# Altium schematic sheet CablineDP.SchDoc
size B
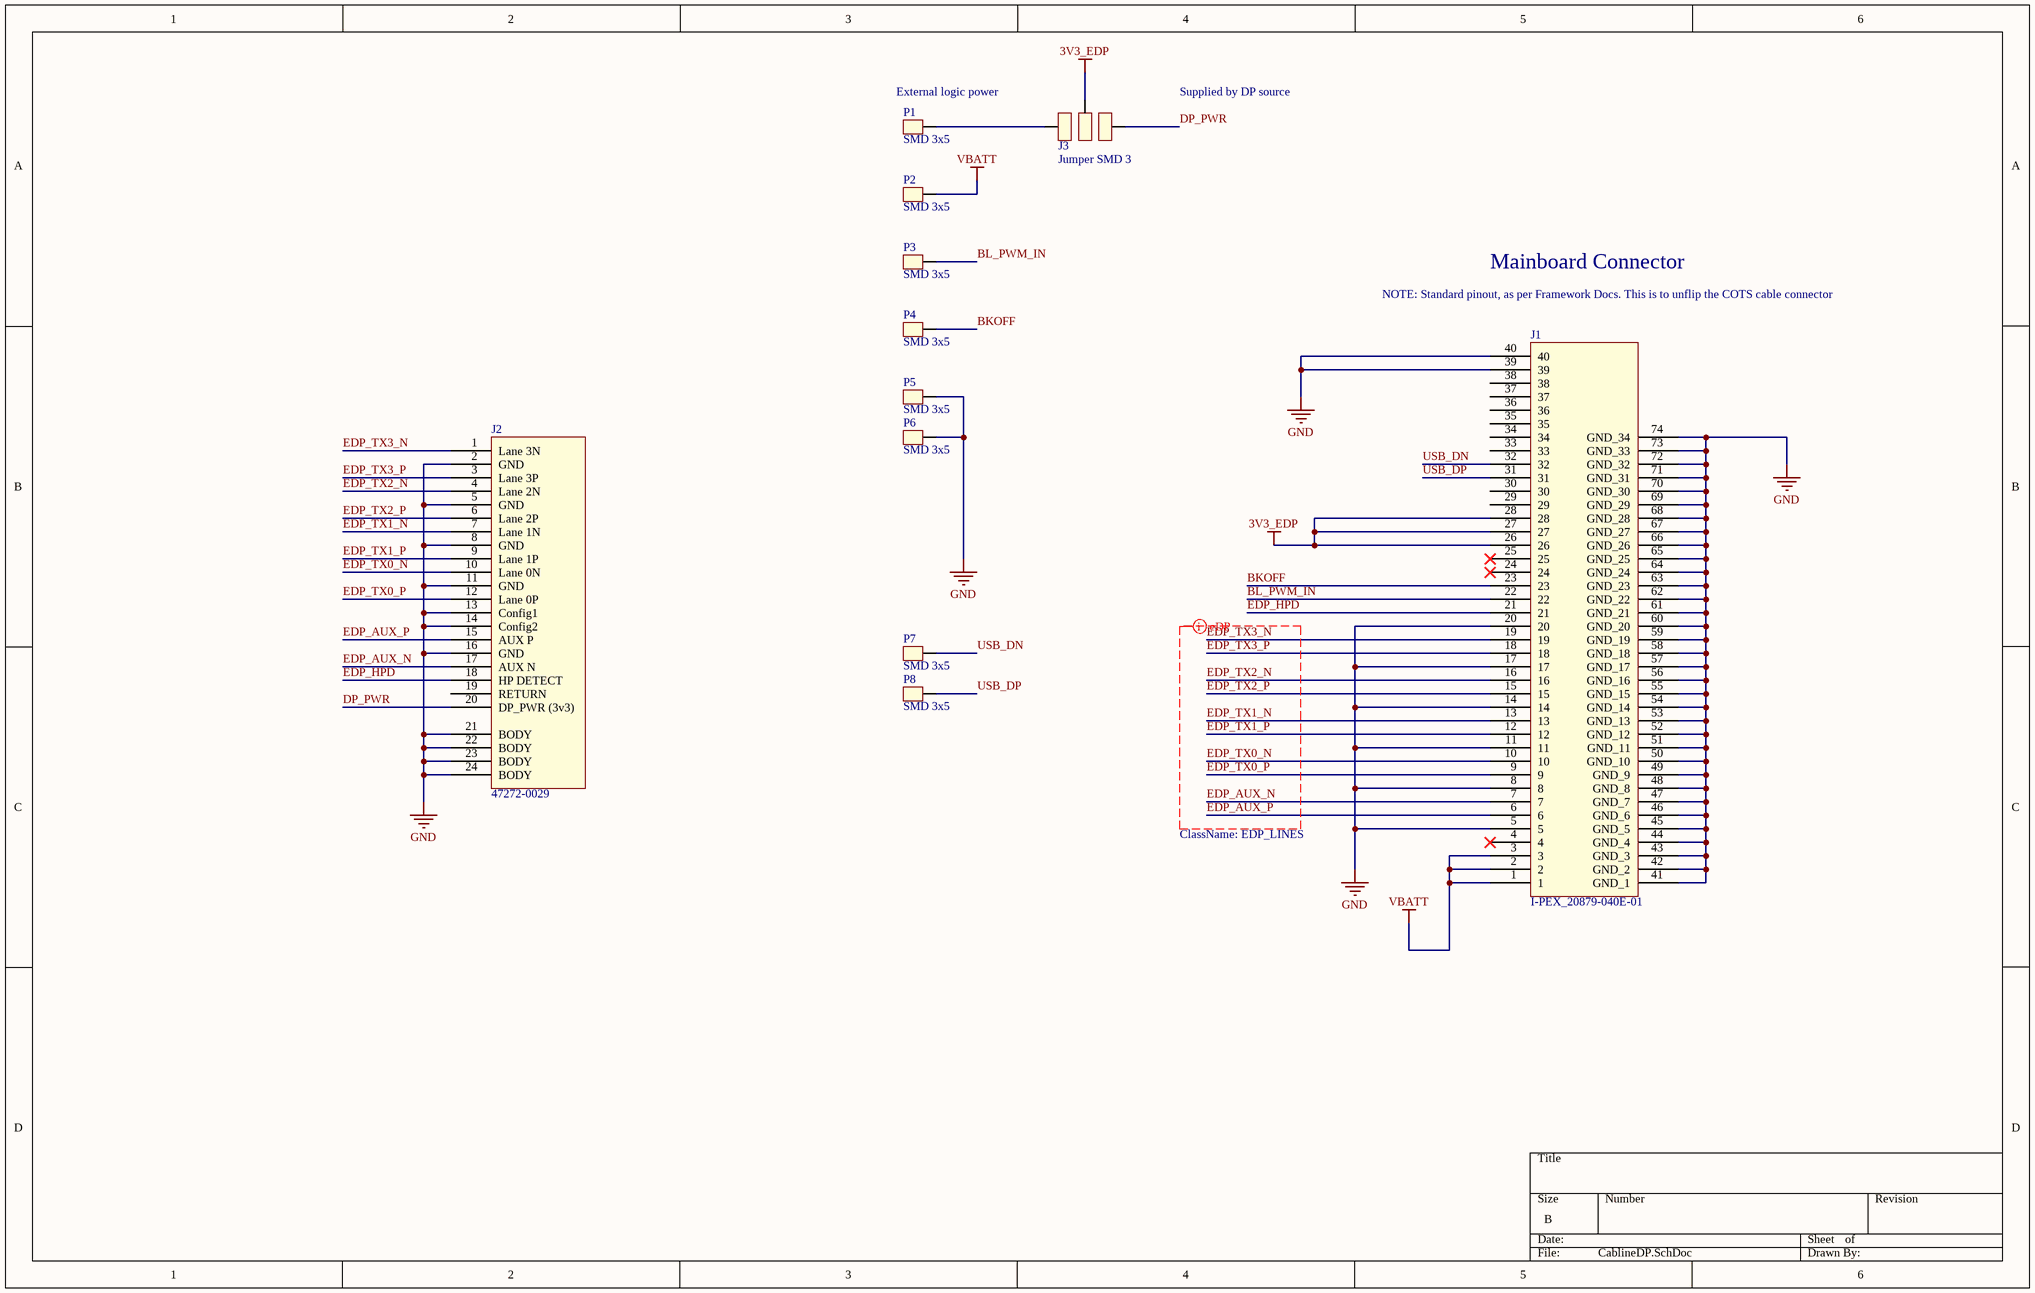
[diagram p0: CablineDP.SchDoc]

## Parts
J1  I-PEX_20879-040E-01  [I-PEX_20879-040E-01]
J2  47272-0029  [47272-0029]
J3  Jumper SMD 3  [Jumper SMD 3]
P1  SMD 3x5  [SMD 3x5]
P2  SMD 3x5  [SMD 3x5]
P3  SMD 3x5  [SMD 3x5]
P4  SMD 3x5  [SMD 3x5]
P5  SMD 3x5  [SMD 3x5]
P6  SMD 3x5  [SMD 3x5]
P7  SMD 3x5  [SMD 3x5]
P8  SMD 3x5  [SMD 3x5]

## Nets
3V3_EDP: J1.26 J1.27 J1.28 J3.2
GND: J1.5 J1.8 J1.11 J1.14 J1.17 J1.20 J1.39 J1.40 J1.41(GND_1) J1.42(GND_2) J1.43(GND_3) J1.44(GND_4) J1.45(GND_5) J1.46(GND_6) J1.47(GND_7) J1.48(GND_8) J1.49(GND_9) J1.50(GND_10) J1.51(GND_11) J1.52(GND_12) J1.53(GND_13) J1.54(GND_14) J1.55(GND_15) J1.56(GND_16) J1.57(GND_17) J1.58(GND_18) J1.59(GND_19) J1.60(GND_20) J1.61(GND_21) J1.62(GND_22) J1.63(GND_23) J1.64(GND_24) J1.65(GND_25) J1.66(GND_26) J1.67(GND_27) J1.68(GND_28) J1.69(GND_29) J1.70(GND_30) J1.71(GND_31) J1.72(GND_32) J1.73(GND_33) J1.74(GND_34) J2.2(GND) J2.5(GND) J2.8(GND) J2.11(GND) J2.13(Config1) J2.14(Config2) J2.16(GND) J2.21(BODY) J2.22(BODY) J2.23(BODY) J2.24(BODY) P5.1 P6.1
VBATT: J1.1 J1.2 J1.3 P2.1
BKOFF: J1.23 P4.1
BL_PWM_IN: J1.22 P3.1
DP_PWR: J2.20(DP_PWR_(3v3)) J3.1
EDP_AUX_N: J1.7 J2.17(AUX_N)
EDP_AUX_P: J1.6 J2.15(AUX_P)
EDP_HPD: J1.21 J2.18(HP_DETECT)
EDP_TX0_N: J1.10 J2.10(Lane_0N)
EDP_TX0_P: J1.9 J2.12(Lane_0P)
EDP_TX1_N: J1.13 J2.7(Lane_1N)
EDP_TX1_P: J1.12 J2.9(Lane_1P)
EDP_TX2_N: J1.16 J2.4(Lane_2N)
EDP_TX2_P: J1.15 J2.6(Lane_2P)
EDP_TX3_N: J1.19 J2.1(Lane_3N)
EDP_TX3_P: J1.18 J2.3(Lane_3P)
USB_DN: J1.32 P7.1
USB_DP: J1.31 P8.1
NetJ3_3: J3.3 P1.1

Not connected (* = marked no-connect by the designer): J1 4* 24* 25* 29 30 33 34 35 36 37 38; J2 19(RETURN)

## Layout directives
differential pair; net class EDP_LINES: EDP_AUX_N, EDP_AUX_P, EDP_TX0_N, EDP_TX0_P, EDP_TX1_N, EDP_TX1_P, EDP_TX2_N, EDP_TX2_P, EDP_TX3_N, EDP_TX3_P

## Notes on the sheet
- External logic power
- Supplied by DP source
- NOTE: Standard pinout, as per Framework Docs. This is to unflip the COTS cable connector
- Mainboard Connector

## Library data of the parts
J2 = 47272-0029: Molex displayport connector